# EAGLE design K-Diag - double (EAGLE 6.5.0)
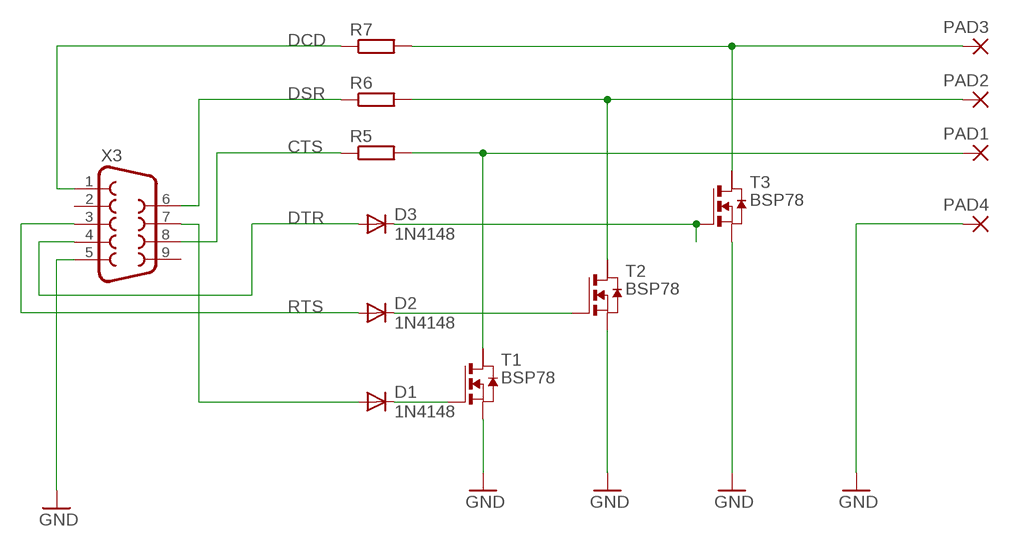
[diagram p0: schematic, sheet 1]

## Parts
D1  1N4148  DIODE-DO214AC  [DO214AC]
D2  1N4148  DIODE-DO214AC  [DO214AC]
D3  1N4148  DIODE-DO214AC  [DO214AC]
PAD1  2,54/0,8  [2,54/0,8]
PAD2  2,54/0,8  [2,54/0,8]
PAD3  2,54/0,8  [2,54/0,8]
PAD4  2,54/0,8  [2,54/0,8]
R5  R-EU_R0805  [R0805]
R6  R-EU_R0805  [R0805]
R7  R-EU_R0805  [R0805]
T1  BSP78  NMOSSOT223  [SOT223]
T2  BSP78  NMOSSOT223  [SOT223]
T3  BSP78  NMOSSOT223  [SOT223]
X3  F09D  [F09D]

## Nets
CTS: R5.1 X3.8
DCD: R7.1 X3.1
DSR: R6.1 X3.6
DTR: D3.A X3.4
GND: PAD4.1(P) T1.3(S) T2.3(S) T3.3(S) X3.5
N$1: D3.C T3.1(G)
N$2: D2.C T2.1(G)
N$3: D1.C T1.1(G)
N$4: PAD1.1(P) R5.2 T1.2(D)
N$5: PAD2.1(P) R6.2 T2.2(D)
N$6: PAD3.1(P) R7.2 T3.2(D)
N$7: D1.A X3.7
RTS: D2.A X3.3
Unconnected: T1.4(D2) T2.4(D2) T3.4(D2) X3.2 X3.9

## Library data of the parts
D1-D3 = diode:DIODE-: DIODE
PAD1-PAD4 = wirepad:2,54/0,8: THROUGH-HOLE PAD
R5-R7 = rcl:R-EU_: RESISTOR, European symbol
T1-T3 = zetex:NMOSSOT223: MOS FET
X3 = con-subd:F09: SUB-D; OC_FARNELL: unknown; OC_NEWARK: unknown

## Board
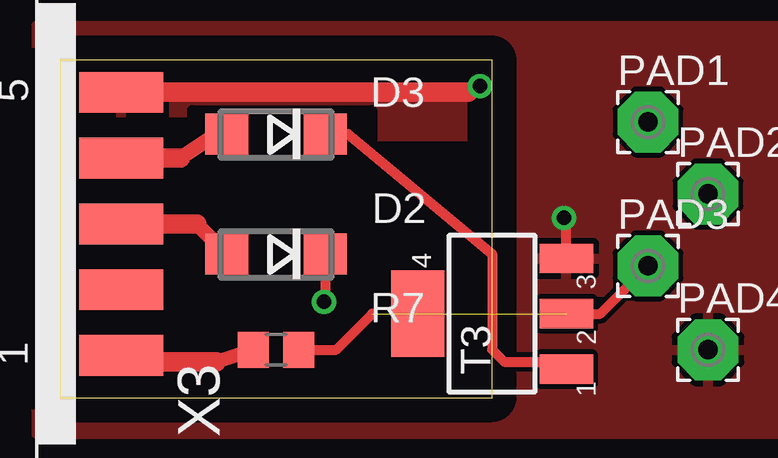
[diagram p1: board, top side]
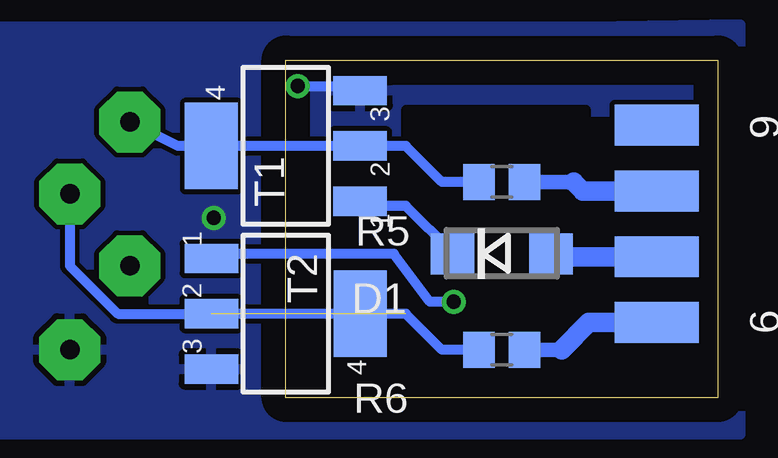
[diagram p2: board, bottom side, seen from below]

Size 18 x 14.09 mm. Coordinates in mm from the lower left corner, seen from the top.
Outline: 0,0 18,0 18,14.09 0,14.09 0,0
Copper layers (1*16): Top 0.035mm / dielectric 1.5mm / Bottom 0.035mm
Design rules "default": minimum track width 10mil, minimum drill 24mil, track to track 8mil, track to pad 8mil, pad to pad 8mil, via to via 8mil, smd to smd 8mil, copper to edge 40mil, drill to drill 8mil, minimum pad ring 10mil, minimum via ring 8mil, stop-mask expansion 4mil, vias tented up to drill 0mil, thermal gap 10mil
tRestrict: area 0,0.5 to 18,12
bRestrict: area 0,0.5 to 18,12

### Footprints (pad centres in the part's own frame; a part is rotated, then mirrored left to right if it is on the bottom)
DO214AC = smd 1.8 x 1.7: A 2.05,0; C -2.05,0
2,54/0,8 = drill 0.813 pad 2.54 octagon: 1 0,0
R0805 = smd 1.3 x 1.5: 1 -0.95,0; 2 0.95,0
SOT223 = smd 1.219 x 2.235: 1 -2.311,-3.099; 2 0,-3.099; 3 2.311,-3.099 | smd 3.6 x 2.2: 4 0,3.099
F09D = smd 1.7 x 3.5: 1 -5.486,-6.045; 2 -2.743,-6.045; 3 0,-6.045; 4 2.743,-6.045; 5 5.486,-6.045 | smd 1.7 x 3.5 bottom: 6 -4.115,-6.045; 7 -1.372,-6.045; 8 1.372,-6.045; 9 4.115,-6.045

### Placement (x,y rotation side)
D1  9,6 0 bottom
D2  9,6 180 top
D3  9,11 180 top
PAD1  24.5,11.5 0 top  (outside the outline)
PAD2  27,8.5 0 top  (outside the outline)
PAD3  24.5,5.5 0 top  (outside the outline)
PAD4  27,2 0 top  (outside the outline)
R5  9,9 180 bottom
R6  9,2 180 bottom
R7  9,2 0 top
T1  18,10.5 90 bottom
T2  18,3.5 270 bottom
T3  18,3.5 90 top
X3  -3.5,7.25 90 top

### Tracks (layer width: path | path; a pad name or v marks a point on that pad's centre or on a via)
CTS
  Bottom 0.61: 6,9 R5.1
  Bottom 0.813: X3.8 5.62,8.62 6,9
DCD
  Top 0.406: 2.78,2 X3.1
  Top 0.61: R7.1 6.5,1.5
  Top 0.813: 6.5,1.5 4,1.5 2.78,2
DSR
  Bottom 0.61: 6.5,2 R6.1
  Bottom 0.813: X3.6 5.37,3.13 6.5,2
DTR
  Top 0.406: D3.A 6.45,10.95 | 2.55,10 X3.4
  Top 0.61: 6.45,10.95 5,10
  Top 0.813: 5,10 2.55,10
GND  (via drill 0.6)
  Top 0.406: X3.5 3.24,12.74 | 17,12.75 v17.5,13 | T3.3 21.1,7.4 v21,7.5
  Top 0.813: 3.24,12.74 5,12.75 17,12.75
  Bottom 0.406: v17.5,13 15.09,13 T1.3
  pour Bottom: 5.5,15.47 32.25,15.47 32.25,-1.54 -0.95,-1.54 -0.95,15.57
  pour Top: 32,-1.5 32,15.5 -1,15.5 -1,-1.5
N$1
  Top 0.406: D3.C 12,11 18,6 18,2 18.5,1.5 20.79,1.5 T3.1
N$2  (via drill 0.6)
  Top 0.406: D2.C 11.05,4.05 v11,4
  Bottom 0.406: v11,4 12,4 13.5,6 20.91,6 T2.1
N$3
  Bottom 0.406: D1.C 11.05,6.05 13,8 14.71,8 T1.1
N$4
  Bottom 0.406: R5.2 11.5,9 13,10.5 T1.2 22.5,10.5 PAD1.1
N$5
  Bottom 0.406: R6.2 11.5,2 13,3.5 T2.2 25,3.5 27,5.5 PAD2.1
N$6  (1 unrouted)
  Top 0.406: R7.2 11.5,2 13,3.5 | T3.2 22.5,3.5 PAD3.1
N$7
  Bottom 0.406: 6.83,5.88 D1.A
  Bottom 0.813: X3.7 6.83,5.88
RTS
  Top 0.61: 5.7,7.25 D2.A
  Top 0.813: X3.3 5.7,7.25